# EAGLE design mosquino-power-piezo (EAGLE 5.08)
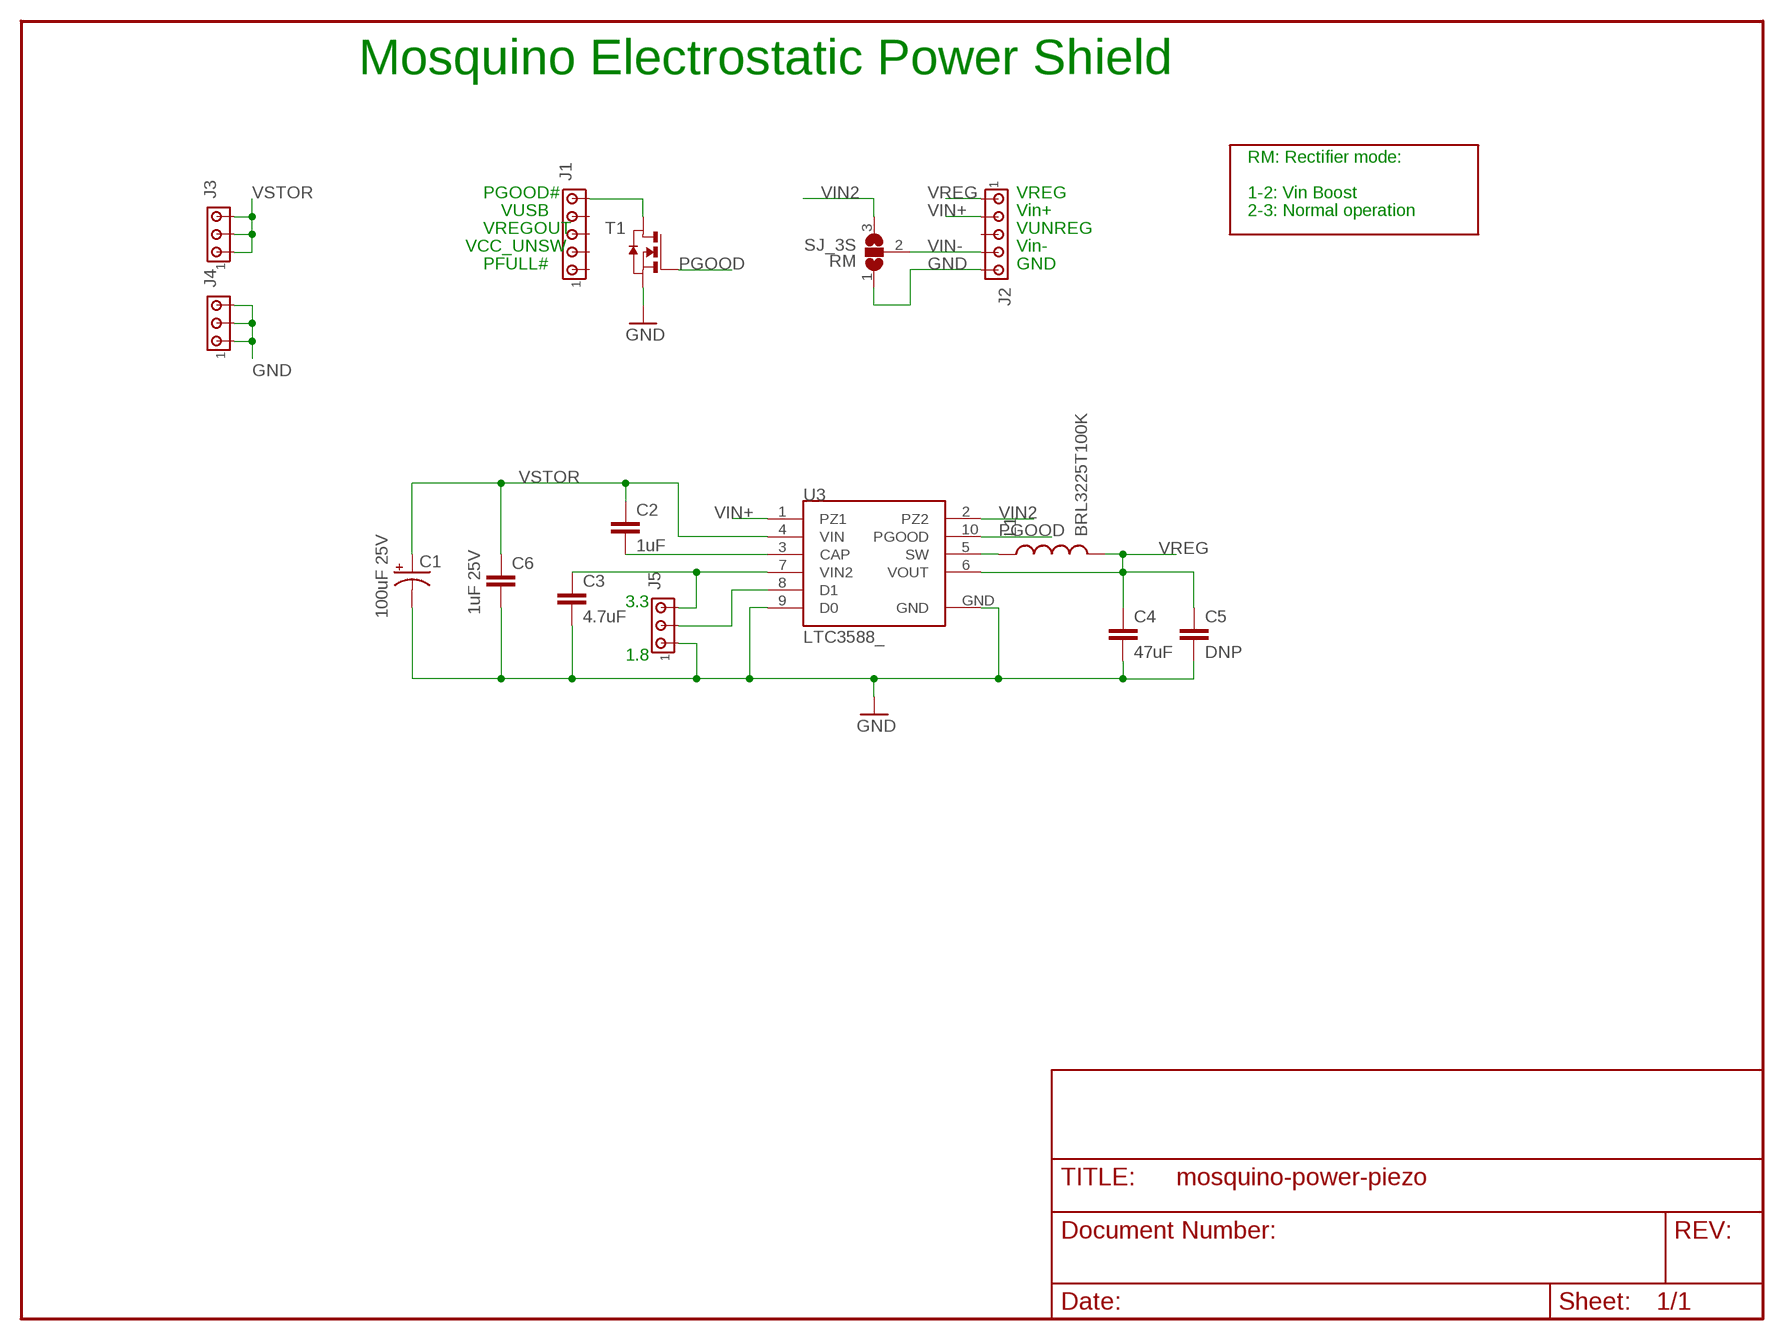
[diagram p0: schematic, sheet 1]

## Parts
C1  100uF 25V  CPOL-USD  [PANASONIC_D]
C2  1uF  C-EUC0805  [C0805]
C3  4.7uF  C-EUC0805  [C0805]
C4  47uF  C-EUC0805  [C0805]
C5  DNP  C-EUC0805  [C0805]
C6  1uF 25V  C-EUC0805  [C0805]
J1  MTA05-100  [10X05MTA]
J2  MTA05-100  [10X05MTA]
J3  MTA03-100  [10X03MTA]
J4  MTA03-100  [10X03MTA]
J5  MTA03-100  [10X03MTA]
L1  BRL3225T100K  INDUCTOR1210  [1210]
RM  SJ_3S  [SJ3_S]
T1  NMOSSOT23  [SOT-23]
U3  LTC3588_  [MSOP-10-GNDPAD]

## Nets
GND [pwr]: C1.- C3.2 C4.2 C5.2 C6.2 J2.5 J4.1 J4.2 J4.3 J5.1 RM.1 T1.2(S) U3.9(D0) U3.GND
N$2: J1.5 T1.1(D)
N$5: C2.2 U3.3(CAP)
N$6 [pwr]: L1.1 U3.5(SW)
N$7: J5.2 U3.8(D1)
N$8: C3.1 J5.3 U3.7(VIN2)
PGOOD: T1.3(G) U3.10(PGOOD)
VIN2 [pwr]: RM.3 U3.2(PZ2)
VIN+ [pwr]: J2.2 U3.1(PZ1)
VIN- [pwr]: J2.4 RM.2
VREG [pwr]: C4.1 C5.1 J2.1 L1.2 U3.6(VOUT)
VSTOR [pwr]: C1.+ C2.1 C6.1 J3.1 J3.2 J3.3 U3.4(VIN)
Unconnected: J1.1 J1.2 J1.3 J1.4 J2.3

## Notes on the sheet
- Mosquino Electrostatic Power Shield
- RM: Rectifier mode:
- PGOOD# | VREG | 1-2: Vin Boost
- VUSB | Vin+ | 2-3: Normal operation
- VREGOUT | VUNREG
- VCC_UNSW | Vin-
- PFULL# | GND
- 3.3
- 1.8

## Library data of the parts
C1 = rcl:CPOL-US: POLARIZED CAPACITOR, American symbol
C2-C6 = rcl:C-EU: CAPACITOR, European symbol
J1 J2 = con-amp:MTA05-100: AMP connector
J3-J5 = con-amp:MTA03-100: AMP connector
L1 = SparkFun:INDUCTOR: Inductors Basic Inductor/Choke - 0603 and 1206. Footprints are not proven and vary greatly between part numbers.
RM = mideeval:SJ_3S: Small solder jumper, 3 pin. 20060130 / tgipson
T1 = zetex:NMOSSOT23: MOS FET
U3 = SparkFun:LTC3588: LTC3588 Energy Harvesting Power Supply

## Net classes
0 default: width 0.203 mm
1 pwr: width 0.203 mm, drill 0.381 mm, clearance 0.203 mm
4 digital: width 0.203 mm, drill 0.381 mm, clearance 0.203 mm

## Board
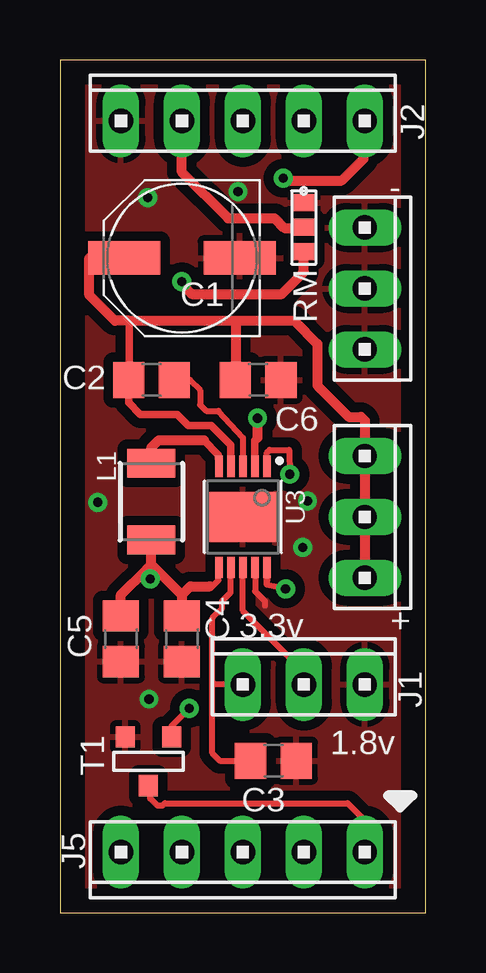
[diagram p1: board, top side]
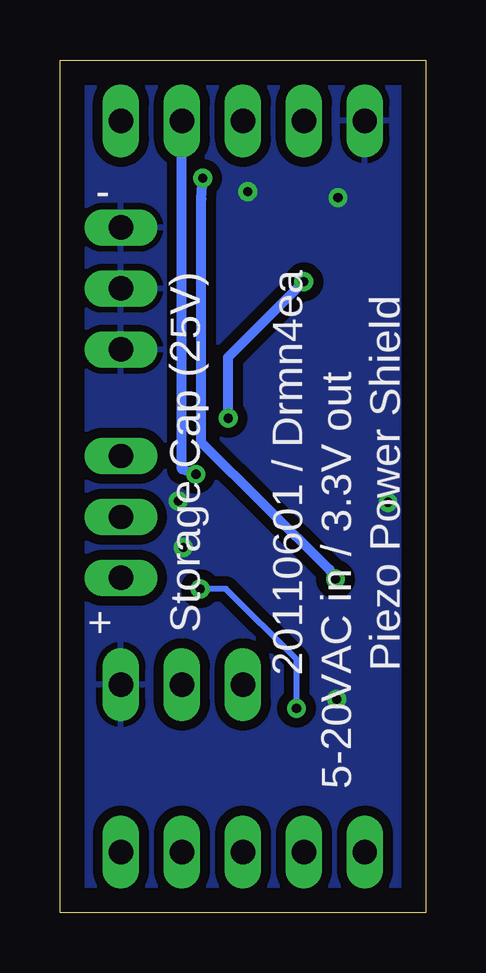
[diagram p2: board, bottom side, seen from below]

Size 15.24 x 35.56 mm. Coordinates in mm from the lower left corner, seen from the top.
Outline: 15.24,35.56 0,35.56 0,0 15.24,0 15.24,35.56
Copper layers (1*16): Top 0.035mm / dielectric 1.5mm / Bottom 0.035mm
Design rules "default": minimum track width 8mil, minimum drill 15mil, track to track 8mil, track to pad 8mil, pad to pad 8mil, via to via 8mil, smd to smd 8mil, copper to edge 40mil, drill to drill 8mil, minimum pad ring 10mil, minimum via ring 8mil, stop-mask expansion 4mil, vias tented up to drill 0mil, thermal gap 10mil

### Footprints (pad centres in the part's own frame; a part is rotated, then mirrored left to right if it is on the bottom)
PANASONIC_D = smd 3 x 1.4: + 2.4,0; - -2.4,0
C0805 = smd 1.3 x 1.5: 1 -0.95,0; 2 0.95,0
10X05MTA = drill 1.016 long: 1 5.08,0; 2 2.54,0; 3 0,0; 4 -2.54,0; 5 -5.08,0
10X03MTA = drill 1.016 long: 1 2.54,0; 2 0,0; 3 -2.54,0
1210 = smd 1.2 x 2: 1 -1.6,0; 2 1.6,0
SJ3_S = smd 0.7 x 0.9: 1 -1.031,0; 2 -0.015,0; 3 1.001,0
SOT-23 = smd 0.787 x 0.889: 1 0.025,-1.016; 2 -0.94,1.016; 3 0.991,1.016
MSOP-10-GNDPAD = smd 0.305 x 0.889: 1 -1,-2.11; 2 -0.5,-2.11; 3 0,-2.11; 4 0.5,-2.11; 5 1,-2.11; 6 1,2.11; 7 0.5,2.11; 8 0,2.11; 9 -0.5,2.11; 10 -1,2.11 | smd 2.794 x 2.083: GND 0,0

### Placement (x,y rotation side)
C1  5.08,27.3 180 top
C2  3.81,22.23 0 top
C3  8.89,6.35 0 top
C4  5.08,11.43 270 top
C5  2.54,11.43 270 top
C6  8.26,22.23 0 top
J1  7.62,2.54 180 top
J2  7.62,33.02 0 top
J3  12.7,16.51 270 top
J4  12.7,26.04 270 top
J5  10.16,9.53 0 top
L1  3.81,17.14 270 top
RM  10.16,28.57 270 top
T1  3.66,6.32 0 top
U3  7.62,16.51 180 top

### Tracks (layer width: path | path; a pad name or v marks a point on that pad's centre or on a via)
GND  (via drill 0.38)
  Top 0.203: U3.9 8.13,14.33
  Top 0.254: U3.9 8.13,13.41 8.53,13.01 8.53,12.8
  other vias: 10.11,15.24 1.57,17.12 3.71,8.92 3.66,29.82 10.31,17.17 7.42,30.07
  pour Top (isolate 0.406): 15.24,35.56 15.24,0 0,0 0,35.56
  pour Bottom (isolate 0.406): 0,35.56 0,0 15.24,0 15.24,35.56
  pour Top (no thermals): 8.94,15.44 9.35,15.44 9.35,17.48 8.94,17.48
N$2
  Top 0.254: T1.1 3.76,5.23 3.76,4.78 4.06,4.47 4.27,4.47 4.37,4.57 11.99,4.57 12.7,3.86 J1.5
N$5
  Top 0.254: U3.3 7.62,19.81 6.6,20.93 6.1,20.93 5.84,21.18 5.84,21.79 5.41,22.23 C2.2
N$6
  Top 0.254: U3.5 6.6,18.64
  Top 0.305: U3.5 6.62,18.93 6.6,18.95 6.6,19.1 5.99,19.71
  Top 0.406: 5.99,19.71 4.12,19.71 3.81,19.41 L1.1
N$7
  Top 0.254: U3.8 7.62,12.6 10.16,10.06 J5.2
N$8
  Top 0.203: 7.11,14.33 U3.7
  Top 0.254: 7.11,14.33 7.11,13.36 6.76,13.01 6.76,12.7 6.35,12.29 6.35,9.55 | 6.35,9.55 6.35,6.66 6.66,6.35 C3.1 | J5.3 7.59,9.55 6.35,9.55
PGOOD  (via drill 0.38)
  Top 0.203: U3.10 8.64,14.33
  Top 0.254: 8.64,14.33 8.64,13.87 | v9.4,13.51 8.62,13.68 U3.10 | v5.38,8.53 4.65,7.8 T1.3
  Bottom 0.254: v5.38,8.53 5.38,10.57 8.33,13.51 v9.4,13.51
VIN2  (via drill 0.38)
  Top 0.305: 8.23,19.81 8.12,19.7 U3.2
  Top 0.406: RM.3 10.16,26.72 9.25,25.81 5.49,25.81 5.08,26.21 v5.08,26.31 | 8.23,19.81 v8.23,20.62
  Bottom 0.406: v5.08,26.31 8.23,23.16 v8.23,20.62
VIN+  (via drill 0.38)
  Top 0.254: U3.1 8.62,19.19 8.74,19.3 9.55,19.3 v9.58,18.29
  Bottom 0.406: J2.2 10.16,18.49 v9.58,18.29
VIN-
  Top 0.406: RM.2 10.12,28.55 9.35,28.55 8.94,28.96 7.01,28.96 5.08,30.89 J2.4
VREG  (via drill 0.38)
  Top 0.203: 6.6,14.33 U3.6 | C5.1 2.54,12.39 | C4.1 5.08,12.39 | 3.76,15.34 3.76,15.54 L1.2 3.76,15.34
  Top 0.254: 6.6,14.33 6.6,13.87 6.35,13.61 6.25,13.61
  Top 0.406: 3.76,15.34 3.81,15.29 3.81,14.53 | 3.81,14.53 5.08,13.26 | 5.08,13.26 C4.1 | 3.63,14.35 3.81,14.53 | 3.63,14.35 2.54,13.26 C5.1 | 6.25,13.61 5.44,13.61 5.08,13.26 | v3.76,13.92 3.63,14.05 3.63,14.35 | J2.1 12.65,32.97 12.65,31.45 11.73,30.53 9.4,30.53 v9.3,30.63
  Bottom 0.406: v9.3,30.63 9.35,29.77 9.35,19.61 4.01,14.33 v3.76,13.92
VSTOR
  Top 0.203: J3.3 12.7,19.1
  Top 0.305: U3.4 7.12,19.3 7.11,19.3 7.11,19.51 6.3,20.32 5.33,20.32 4.88,20.78 3.35,20.78 2.86,21.27 C2.1 2.9,22.26 2.9,24.69
  Top 0.406: J3.1 J3.2 J3.3 12.7,20.52 12.55,20.68 12.04,20.68 10.72,22 10.72,23.72 9.75,24.69 7.32,24.69 | C1.+ 1.22,27.3 1.22,25.76 2.29,24.69 2.9,24.69 7.32,24.69 | C6.1 7.32,24.69

### Text on the board
tPlace: - | + | 3.3v | 1.8v
bNames: - | Piezo Power Shield | + | Storage Cap (25V) | 20110601 / Drmn4ea | 5-20VAC in / 3.3V out